# EAGLE schematic Display Pics (EAGLE 6.4)

## Sheet 1 of 9
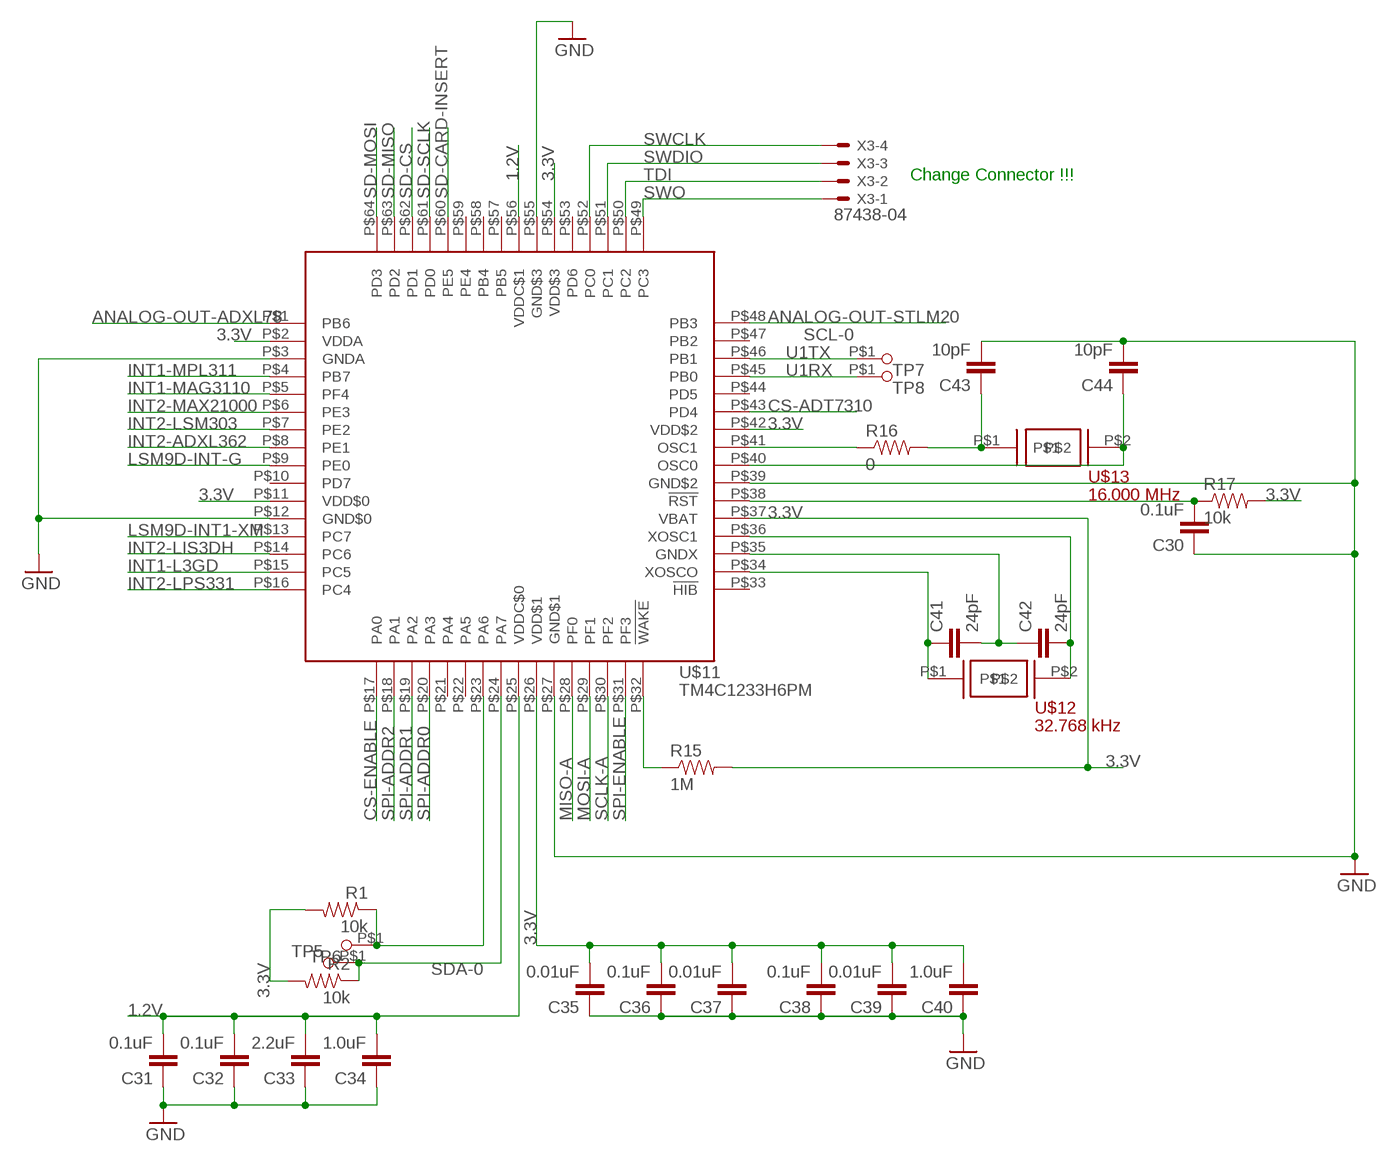
[diagram p0: schematic, sheet 1]

### Parts
C30  0.1uF  CAPACITOR  [0402-CAP]
C31  0.1uF  CAPACITOR  [0402-CAP]
C32  0.1uF  CAPACITOR  [0402-CAP]
C33  2.2uF  CAPACITOR  [0402-CAP]
C34  1.0uF  CAPACITOR  [0402-CAP]
C35  0.01uF  CAPACITOR  [0402-CAP]
C36  0.1uF  CAPACITOR  [0402-CAP]
C37  0.01uF  CAPACITOR  [0402-CAP]
C38  0.1uF  CAPACITOR  [0402-CAP]
C39  0.01uF  CAPACITOR  [0402-CAP]
C40  1.0uF  CAPACITOR  [0402-CAP]
C41  24pF  CAPACITOR  [0402-CAP]
C42  24pF  CAPACITOR  [0402-CAP]
C43  10pF  CAPACITOR  [0402-CAP]
C44  10pF  CAPACITOR  [0402-CAP]
R1  10k  RESISTOR  [0402-RES]
R2  10k  RESISTOR  [0402-RES]
R15  1M  RESISTOR  [0402-RES]
R16  0  RESISTOR  [0402-RES]
R17  10k  RESISTOR  [0402-RES]
TP5  TESTPAD(ROUND)  [TESTPAD(ROUND)]
TP6  TESTPAD(ROUND)  [TESTPAD(ROUND)]
TP7  TESTPAD(ROUND)  [TESTPAD(ROUND)]
TP8  TESTPAD(ROUND)  [TESTPAD(ROUND)]
U$11  TM4C1233H6PM  [S-PQFP-G64]
U$12  32.768 kHz  AB26TRB  [CYLINDRICAL-(1.9DIAX6L)]
U$13  16.000 MHz  NX5032GA  [2-SMD]
X3  87438-04  [87438-04]

### Nets
1.2V: C31.2 C32.2 C33.2 C34.2 U$11.P$25(VDDC$0) U$11.P$56(VDDC$1) ; also sheet 8
3.3V: C35.2 C36.2 C37.2 C38.2 C39.2 C40.2 R1.2 R2.2 R15.2 R17.2 U$11.P$2(VDDA) U$11.P$11(VDD$0) U$11.P$26(VDD$1) U$11.P$37(VBAT) U$11.P$42(VDD$2) U$11.P$54(VDD$3) ; also sheet 2,3,4,5,6,7,8,9
ANALOG-OUT-ADXL78: U$11.P$1(PB6) ; also sheet 6
ANALOG-OUT-STLM20: U$11.P$48(PB3) ; also sheet 6
CS-ADT7310: U$11.P$43(PD4) ; also sheet 4
CS-ENABLE: U$11.P$17(PA0) ; also sheet 7
GND: C30.1 C31.1 C32.1 C33.1 C34.1 C35.1 C36.1 C37.1 C38.1 C39.1 C40.1 C43.2 C44.2 U$11.P$3(GNDA) U$11.P$12(GND$0) U$11.P$27(GND$1) U$11.P$39(GND$2) U$11.P$55(GND$3) ; also sheet 2,3,4,5,6,7,8,9
INT1-L3GD: U$11.P$15(PC5) ; also sheet 3
INT1-MAG3110: U$11.P$5(PF4) ; also sheet 5
INT1-MPL311: U$11.P$4(PB7) ; also sheet 5
INT2-ADXL362: U$11.P$8(PE1) ; also sheet 4
INT2-LIS3DH: U$11.P$14(PC6) ; also sheet 3
INT2-LPS331: U$11.P$16(PC4) ; also sheet 3
INT2-LSM303: U$11.P$7(PE2) ; also sheet 2
INT2-MAX21000: U$11.P$6(PE3) ; also sheet 9
LSM9D-INT1-XM: U$11.P$13(PC7) ; also sheet 2
LSM9D-INT-G: U$11.P$9(PE0) ; also sheet 2
MISO-A: U$11.P$28(PF0) ; also sheet 7
MOSI-A: U$11.P$29(PF1)
N$10: C30.2 R17.1 U$11.P$38(!RST)
N$11: C42.2 U$11.P$36(XOSC1) U$12.P$2
N$12: C41.1 U$11.P$34(XOSCO) U$12.P$1
N$13: C41.2 C42.1 U$11.P$35(GNDX)
N$14: C43.1 R16.2 U$13.P$1
N$16: C44.1 U$11.P$40(OSC0) U$13.P$2
N$17: R16.1 U$11.P$41(OSC1)
N$18: R15.1 U$11.P$32(!WAKE)
SCL-0: R1.1 TP6.P$1 U$11.P$23(PA6) ; also sheet 5
SCLK-A: U$11.P$30(PF2) ; also sheet 7
SD-CARD-INSERT: U$11.P$60(PE5) ; also sheet 7
SD-CS: U$11.P$62(PD1) ; also sheet 7
SD-MISO: U$11.P$63(PD2) ; also sheet 7
SD-MOSI: U$11.P$64(PD3) ; also sheet 7
SD-SCLK: U$11.P$61(PD0) ; also sheet 7
SDA-0: R2.1 TP5.P$1 U$11.P$24(PA7) ; also sheet 5
SPI-ADDR0: U$11.P$20(PA3) ; also sheet 7
SPI-ADDR1: U$11.P$19(PA2) ; also sheet 7
SPI-ADDR2: U$11.P$18(PA1) ; also sheet 7
SPI-ENABLE: U$11.P$31(PF3) ; also sheet 7
SWCLK: U$11.P$52(PC0) X3.4
SWDIO: U$11.P$51(PC1) X3.3
SWO: U$11.P$49(PC3) X3.1
TDI: U$11.P$50(PC2) X3.2
U1RX: TP8.P$1 U$11.P$45(PB0)
U1TX: TP7.P$1 U$11.P$46(PB1)
Unconnected: U$11.P$10(PD7) U$11.P$21(PA4) U$11.P$22(PA5) U$11.P$33(!HIB) U$11.P$44(PD5) U$11.P$47(PB2) U$11.P$53(PD6) U$11.P$57(PB5) U$11.P$58(PB4) U$11.P$59(PE4)

### Notes on the sheet
- Change Connector !!!

## Sheet 2 of 9
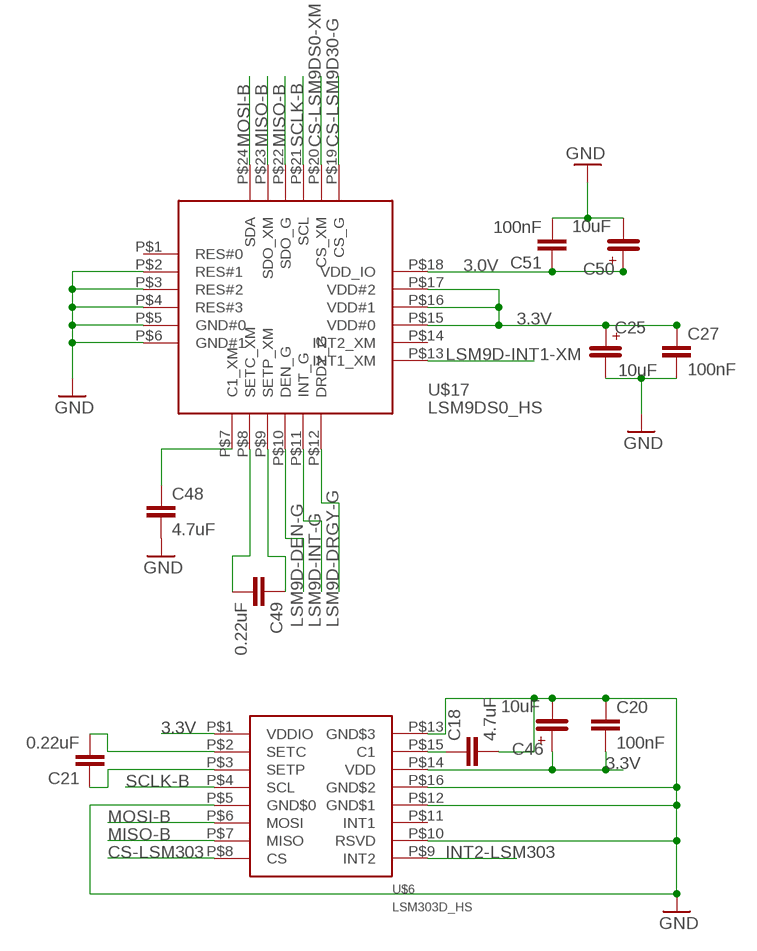
[diagram p1: schematic, sheet 2]

### Parts
C18  4.7uF  CAPACITOR  [0402-CAP]
C20  100nF  CAPACITOR  [0402-CAP]
C21  0.22uF  CAPACITOR  [0402-CAP]
C25  10uF  EEFCD0J100ER  [4.3X7.3SMD]
C27  100nF  CAPACITOR  [0402-CAP]
C46  10uF  EEFCD0J100ER  [4.3X7.3SMD]
C48  4.7uF  CAPACITOR  [0402-CAP]
C49  0.22uF  CAPACITOR  [0402-CAP]
C50  10uF  EEFCD0J100ER  [4.3X7.3SMD]
C51  100nF  CAPACITOR  [0402-CAP]
U$6  LSM303D_HS  [LGA-16(3X3)_HS]
U$17  LSM9DS0_HS  [LGA-24(4X4)_HS]

### Nets
3.0V: C50.P$1 C51.1 U$17.P$18(VDD_IO) ; also sheet 8
3.3V: C20.2 C25.P$1 C27.1 C46.P$1 U$6.P$1(VDDIO) U$6.P$14(VDD) U$17.P$15(VDD#0) U$17.P$16(VDD#1) U$17.P$17(VDD#2) ; also sheet 1,3,4,5,6,7,8,9
CS-LSM9D30-G: U$17.P$19(CS_G) ; also sheet 7
CS-LSM9DS0-XM: U$17.P$20(CS_XM) ; also sheet 7
CS-LSM303: U$6.P$8(CS) ; also sheet 7
GND: C18.2 C20.1 C25.P$2 C27.2 C46.P$2 C48.2 C50.P$2 C51.2 U$6.P$5(GND$0) U$6.P$10(RSVD) U$6.P$12(GND$1) U$6.P$13(GND$3) U$6.P$16(GND$2) U$17.P$2(RES#1) U$17.P$3(RES#2) U$17.P$4(RES#3) U$17.P$5(GND#0) U$17.P$6(GND#1) ; also sheet 1,3,4,5,6,7,8,9
INT2-LSM303: U$6.P$9(INT2) ; also sheet 1
LSM9D-DEN-G: U$17.P$10(DEN_G)
LSM9D-DRGY-G: U$17.P$12(DRDY_G)
LSM9D-INT1-XM: U$17.P$13(INT1_XM) ; also sheet 1
LSM9D-INT-G: U$17.P$11(INT_G) ; also sheet 1
MISO-B: U$6.P$7(MISO) U$17.P$22(SDO_G) U$17.P$23(SDO_XM) ; also sheet 3,4,7,9
MOSI-B: U$6.P$6(MOSI) U$17.P$24(SDA) ; also sheet 3,4,7,9
N$6: C18.1 U$6.P$15(C1)
N$7: C21.2 U$6.P$2(SETC)
N$8: C48.1 U$17.P$7(C1_XM)
N$15: C21.1 U$6.P$3(SETP)
N$21: C49.2 U$17.P$8(SETC_XM)
N$22: C49.1 U$17.P$9(SETP_XM)
SCLK-B: U$6.P$4(SCL) U$17.P$21(SCL) ; also sheet 3,4,7,9
Unconnected: U$6.P$11(INT1) U$17.P$1(RES#0) U$17.P$14(INT2_XM)

## Sheet 3 of 9
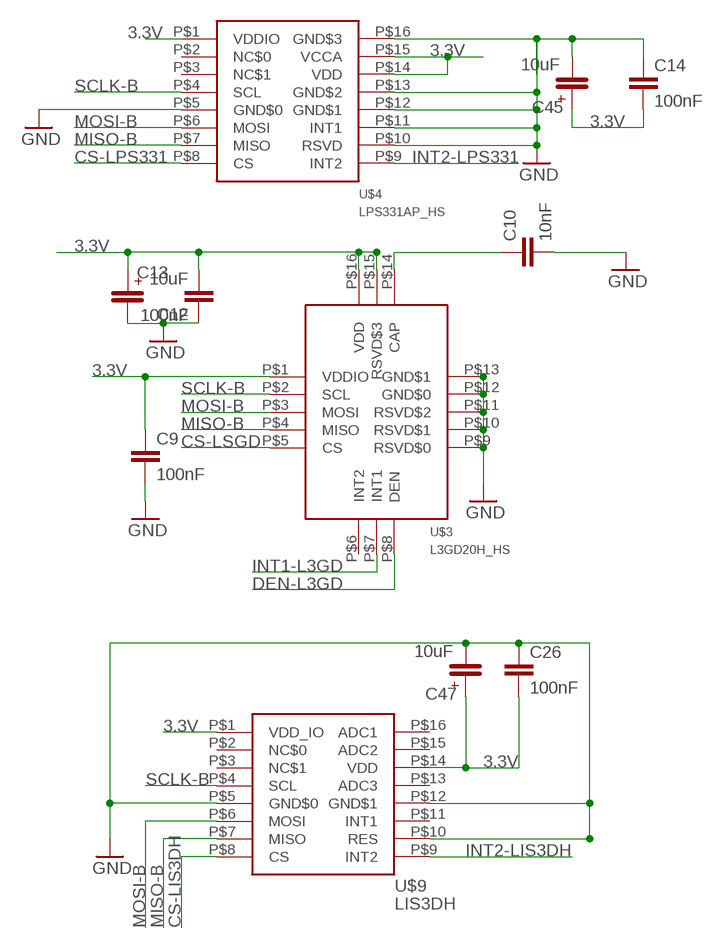
[diagram p2: schematic, sheet 3]

### Parts
C9  100nF  CAPACITOR  [0402-CAP]
C10  10nF  CAPACITOR  [0402-CAP]
C12  10uF  CAPACITOR  [0402-CAP]
C13  100nF  EEFCD0J100ER  [4.3X7.3SMD]
C14  100nF  CAPACITOR  [0402-CAP]
C26  100nF  CAPACITOR  [0402-CAP]
C45  10uF  EEFCD0J100ER  [4.3X7.3SMD]
C47  10uF  EEFCD0J100ER  [4.3X7.3SMD]
U$3  L3GD20H_HS  [LGA-16(3X3)_HS]
U$4  LPS331AP_HS  [LGA-16(3X3)_HS]
U$9  LIS3DH  LIS3DH_HS  [LGA-16(3X3)_HS]

### Nets
3.3V: C9.1 C12.2 C13.P$1 C14.2 C26.2 C45.P$1 C47.P$1 U$3.P$1(VDDIO) U$3.P$15(RSVD$3) U$3.P$16(VDD) U$4.P$1(VDDIO) U$4.P$14(VDD) U$4.P$15(VCCA) U$9.P$1(VDD_IO) U$9.P$14(VDD) ; also sheet 1,2,4,5,6,7,8,9
CS-LIS3DH: U$9.P$8(CS) ; also sheet 7
CS-LPS331: U$4.P$8(CS) ; also sheet 7
CS-LSGD: U$3.P$5(CS) ; also sheet 7
DEN-L3GD: U$3.P$8(DEN)
GND: C9.2 C10.2 C12.1 C13.P$2 C14.1 C26.1 C45.P$2 C47.P$2 U$3.P$9(RSVD$0) U$3.P$10(RSVD$1) U$3.P$11(RSVD$2) U$3.P$12(GND$0) U$3.P$13(GND$1) U$4.P$5(GND$0) U$4.P$10(RSVD) U$4.P$11(INT1) U$4.P$12(GND$1) U$4.P$13(GND$2) U$4.P$16(GND$3) U$9.P$5(GND$0) U$9.P$10(RES) U$9.P$12(GND$1) ; also sheet 1,2,4,5,6,7,8,9
INT1-L3GD: U$3.P$7(INT1) ; also sheet 1
INT2-LIS3DH: U$9.P$9(INT2) ; also sheet 1
INT2-LPS331: U$4.P$9(INT2) ; also sheet 1
MISO-B: U$3.P$4(MISO) U$4.P$7(MISO) U$9.P$7(MISO) ; also sheet 2,4,7,9
MOSI-B: U$3.P$3(MOSI) U$4.P$6(MOSI) U$9.P$6(MOSI) ; also sheet 2,4,7,9
N$4: C10.1 U$3.P$14(CAP)
SCLK-B: U$3.P$2(SCL) U$4.P$4(SCL) U$9.P$4(SCL) ; also sheet 2,4,7,9
Unconnected: U$3.P$6(INT2) U$4.P$2(NC$0) U$4.P$3(NC$1) U$9.P$2(NC$0) U$9.P$3(NC$1) U$9.P$11(INT1) U$9.P$13(ADC3) U$9.P$15(ADC2) U$9.P$16(ADC1)

## Sheet 4 of 9
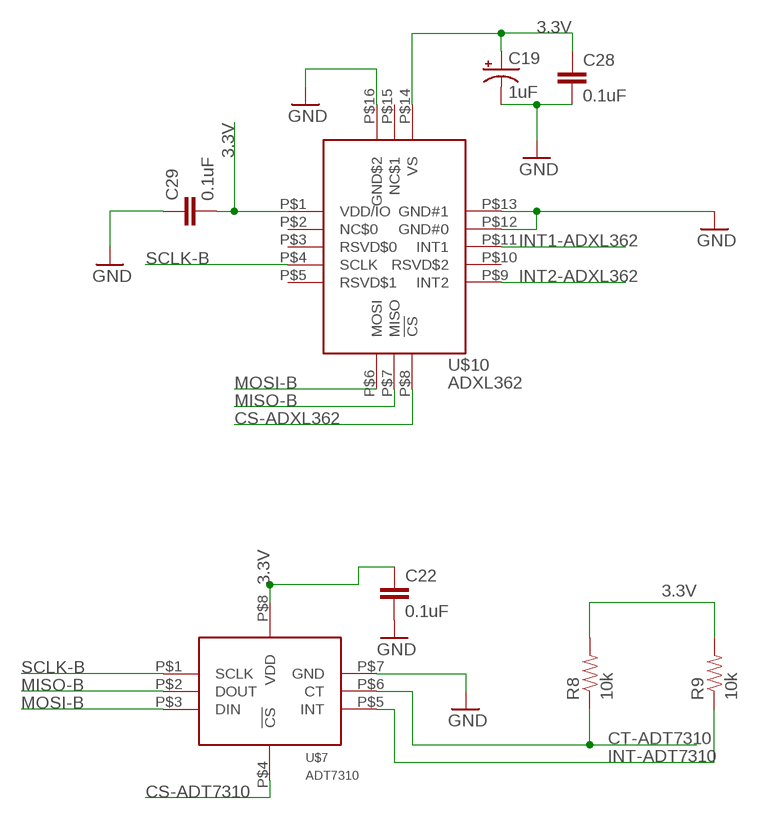
[diagram p3: schematic, sheet 4]

### Parts
C19  1uF  CAP_POL6032  [EIA6032]
C22  0.1uF  CAPACITOR  [0402-CAP]
C28  0.1uF  CAPACITOR  [0402-CAP]
C29  0.1uF  CAPACITOR  [0402-CAP]
R8  10k  RESISTOR  [0402-RES]
R9  10k  RESISTOR  [0402-RES]
U$7  ADT7310  [SOIC-8(5X6.2)]
U$10  ADXL362  ADXL362_HS  [LGA-16(3X3.25)_HS]

### Nets
3.3V: C19.P$1(+) C22.1 C28.1 C29.2 R8.2 R9.2 U$7.P$8(VDD) U$10.P$1(VDD/IO) U$10.P$14(VS) ; also sheet 1,2,3,5,6,7,8,9
CS-ADT7310: U$7.P$4(!CS) ; also sheet 1
CS-ADXL362: U$10.P$8(!CS) ; also sheet 7
CT-ADT7310: R8.1 U$7.P$6(CT)
GND: C19.P$2(-) C22.2 C28.2 C29.1 U$7.P$7(GND) U$10.P$12(GND#0) U$10.P$13(GND#1) U$10.P$16(GND$2) ; also sheet 1,2,3,5,6,7,8,9
INT1-ADXL362: U$10.P$11(INT1)
INT2-ADXL362: U$10.P$9(INT2) ; also sheet 1
INT-ADT7310: R9.1 U$7.P$5(INT)
MISO-B: U$7.P$2(DOUT) U$10.P$7(MISO) ; also sheet 2,3,7,9
MOSI-B: U$7.P$3(DIN) U$10.P$6(MOSI) ; also sheet 2,3,7,9
SCLK-B: U$7.P$1(SCLK) U$10.P$4(SCLK) ; also sheet 2,3,7,9
Unconnected: U$10.P$2(NC$0) U$10.P$3(RSVD$0) U$10.P$5(RSVD$1) U$10.P$10(RSVD$2) U$10.P$15(NC$1)

## Sheet 5 of 9
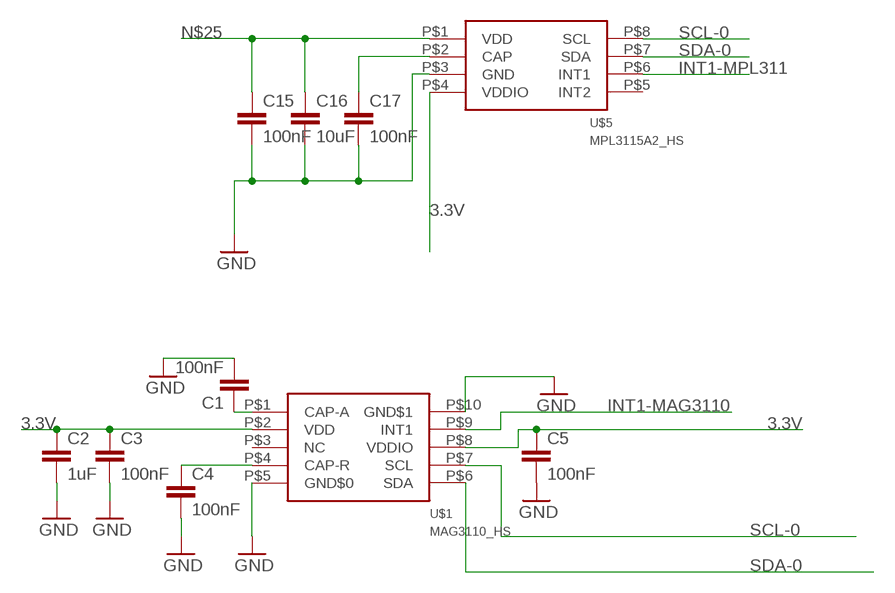
[diagram p4: schematic, sheet 5]

### Parts
C1  100nF  CAPACITOR  [0402-CAP]
C2  1uF  CAPACITOR  [0402-CAP]
C3  100nF  CAPACITOR  [0402-CAP]
C4  100nF  CAPACITOR  [0402-CAP]
C5  100nF  CAPACITOR  [0402-CAP]
C15  100nF  CAPACITOR  [0402-CAP]
C16  10uF  CAPACITOR  [0402-CAP]
C17  100nF  CAPACITOR  [0402-CAP]
U$1  MAG3110_HS  [DFN-10(2X2)_HS]
U$5  MPL3115A2_HS  [LGA-8(5X3)_HS]

### Nets
3.3V: C2.1 C3.1 C5.1 U$1.P$2(VDD) U$1.P$8(VDDIO) U$5.P$4(VDDIO) ; also sheet 1,2,3,4,6,7,8,9
GND: C1.2 C2.2 C3.2 C4.2 C5.2 C15.2 C16.2 C17.2 U$1.P$5(GND$0) U$1.P$10(GND$1) U$5.P$3(GND) ; also sheet 1,2,3,4,6,7,8,9
INT1-MAG3110: U$1.P$9(INT1) ; also sheet 1
INT1-MPL311: U$5.P$6(INT1) ; also sheet 1
N$1: C1.1 U$1.P$1(CAP-A)
N$3: C4.1 U$1.P$4(CAP-R)
N$5: C17.1 U$5.P$2(CAP)
N$25: C15.1 C16.1 U$5.P$1(VDD)
SCL-0: U$1.P$7(SCL) U$5.P$8(SCL) ; also sheet 1
SDA-0: U$1.P$6(SDA) U$5.P$7(SDA) ; also sheet 1
Unconnected: U$1.P$3(NC) U$5.P$5(INT2)

## Sheet 6 of 9
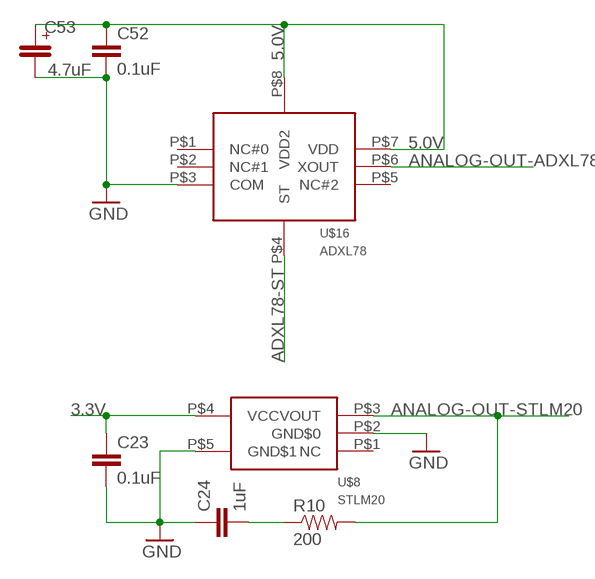
[diagram p5: schematic, sheet 6]

### Parts
C23  0.1uF  CAPACITOR  [0402-CAP]
C24  1uF  CAPACITOR  [0402-CAP]
C52  0.1uF  CAPACITOR  [0402-CAP]
C53  4.7uF  EEFCD0J100ER  [4.3X7.3SMD]
R10  200  RESISTOR  [0402-RES]
U$8  STLM20  [SOT323-5L]
U$16  ADXL78  [LCC-8(5X5)_HS]

### Nets
3.3V: C23.1 U$8.P$4(VCC) ; also sheet 1,2,3,4,5,7,8,9
5.0V: C52.1 C53.P$1 U$16.P$7(VDD) U$16.P$8(VDD2) ; also sheet 8
ADXL78-ST: U$16.P$4(ST)
ANALOG-OUT-ADXL78: U$16.P$6(XOUT) ; also sheet 1
ANALOG-OUT-STLM20: R10.2 U$8.P$3(VOUT) ; also sheet 1
GND: C23.2 C24.1 C52.2 C53.P$2 U$8.P$2(GND$0) U$8.P$5(GND$1) U$16.P$3(COM) ; also sheet 1,2,3,4,5,7,8,9
N$9: C24.2 R10.1
Unconnected: U$8.P$1(NC) U$16.P$1(NC#0) U$16.P$2(NC#1) U$16.P$5(NC#2)

## Sheet 7 of 9
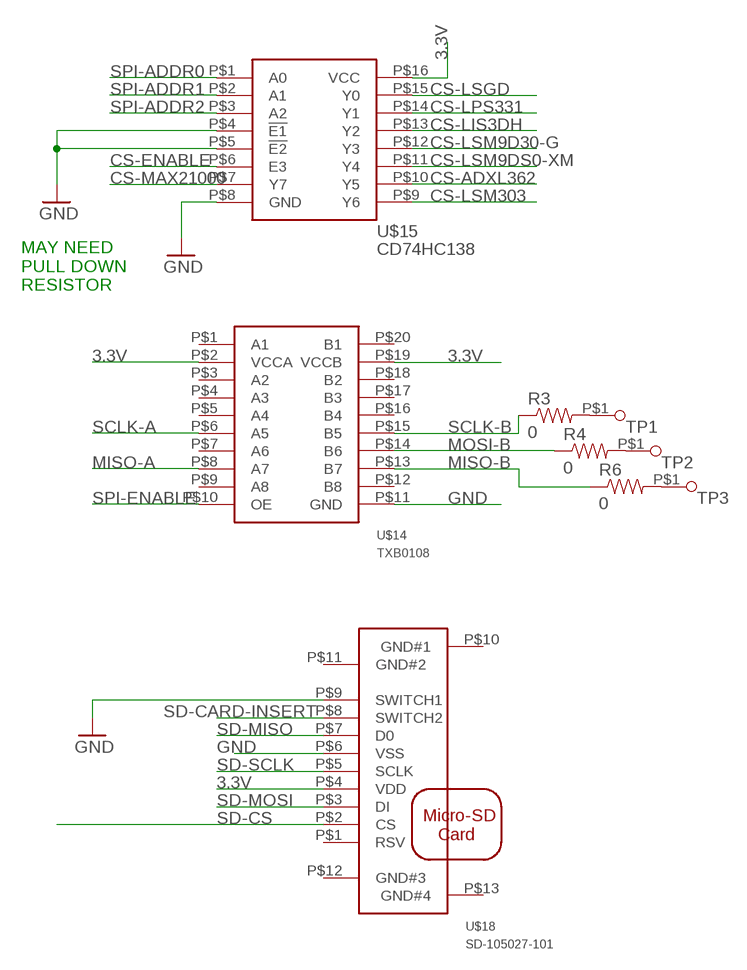
[diagram p6: schematic, sheet 7]

### Parts
R3  0  RESISTOR  [0402-RES]
R4  0  RESISTOR  [0402-RES]
R6  0  RESISTOR  [0402-RES]
TP1  TESTPAD(ROUND)  [TESTPAD(ROUND)]
TP2  TESTPAD(ROUND)  [TESTPAD(ROUND)]
TP3  TESTPAD(ROUND)  [TESTPAD(ROUND)]
U$14  TXB0108  [TSSOP-(PW)-20]
U$15  CD74HC138  [SOIC-16]
U$18  SD-105027-101  [SD-105027-101]

### Nets
3.3V: U$14.P$2(VCCA) U$14.P$19(VCCB) U$15.P$16(VCC) U$18.P$4(VDD) ; also sheet 1,2,3,4,5,6,8,9
CS-ADXL362: U$15.P$10(Y5) ; also sheet 4
CS-ENABLE: U$15.P$6(E3) ; also sheet 1
CS-LIS3DH: U$15.P$13(Y2) ; also sheet 3
CS-LPS331: U$15.P$14(Y1) ; also sheet 3
CS-LSGD: U$15.P$15(Y0) ; also sheet 3
CS-LSM9D30-G: U$15.P$12(Y3) ; also sheet 2
CS-LSM9DS0-XM: U$15.P$11(Y4) ; also sheet 2
CS-LSM303: U$15.P$9(Y6) ; also sheet 2
CS-MAX21000: U$15.P$7(Y7) ; also sheet 9
GND: U$14.P$11(GND) U$15.P$4(!E1) U$15.P$5(!E2) U$15.P$8(GND) U$18.P$6(VSS) U$18.P$9(SWITCH1) ; also sheet 1,2,3,4,5,6,8,9
MISO-A: U$14.P$8(A7) ; also sheet 1
MISO-B: R6.1 U$14.P$13(B7) ; also sheet 2,3,4,9
MOSI-B: R4.1 U$14.P$14(B6) ; also sheet 2,3,4,9
N$32: R3.2 TP1.P$1
N$33: R4.2 TP2.P$1
N$34: R6.2 TP3.P$1
SCLK-A: U$14.P$6(A5) ; also sheet 1
SCLK-B: R3.1 U$14.P$15(B5) ; also sheet 2,3,4,9
SD-CARD-INSERT: U$18.P$8(SWITCH2) ; also sheet 1
SD-CS: U$18.P$2(CS) ; also sheet 1
SD-MISO: U$18.P$7(D0) ; also sheet 1
SD-MOSI: U$18.P$3(DI) ; also sheet 1
SD-SCLK: U$18.P$5(SCLK) ; also sheet 1
SPI-ADDR0: U$15.P$1(A0) ; also sheet 1
SPI-ADDR1: U$15.P$2(A1) ; also sheet 1
SPI-ADDR2: U$15.P$3(A2) ; also sheet 1
SPI-ENABLE: U$14.P$10(OE) ; also sheet 1
Unconnected: U$14.P$1(A1) U$14.P$3(A2) U$14.P$4(A3) U$14.P$5(A4) U$14.P$7(A6) U$14.P$9(A8) U$14.P$12(B8) U$14.P$16(B4) U$14.P$17(B3) U$14.P$18(B2) U$14.P$20(B1) U$18.P$1(RSV) U$18.P$10(GND#1) U$18.P$11(GND#2) U$18.P$12(GND#3) U$18.P$13(GND#4)

### Notes on the sheet
- MAY NEED
  PULL DOWN
  RESISTOR

## Sheet 8 of 9
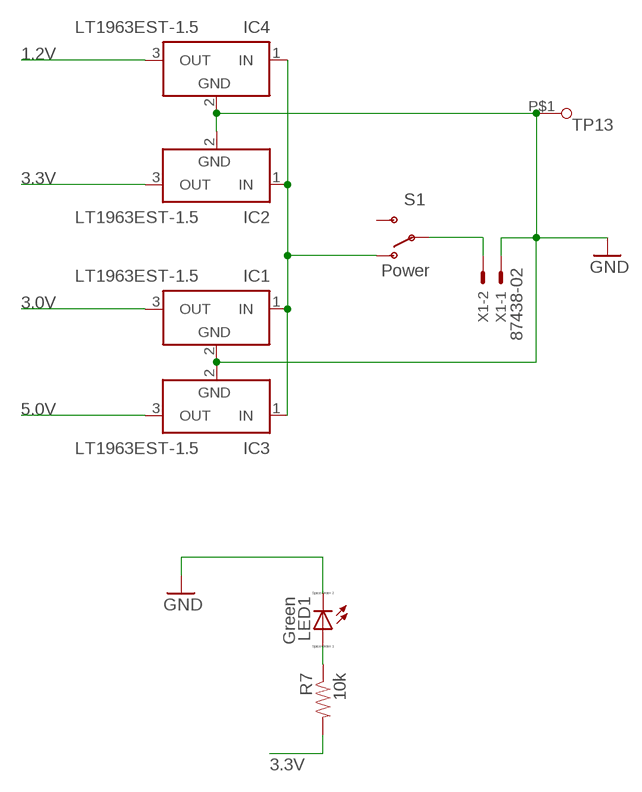
[diagram p7: schematic, sheet 8]

### Parts
IC1  LT1963EST-1.5  [SOT223]
IC2  LT1963EST-1.5  [SOT223]
IC3  LT1963EST-1.5  [SOT223]
IC4  LT1963EST-1.5  [SOT223]
LED1  Green  LED_ESML0603  [LED_SML0603]
R7  10k  RESISTOR  [0402-RES]
S1  Power  SWITCH-SPDT-SMD-A  [SWITCH-SPST-SMD-A]
TP13  TESTPAD(ROUND)  [TESTPAD(ROUND)]
X1  87438-02  [87438-02]

### Nets
1.2V: IC4.3(OUT) ; also sheet 1
3.0V: IC1.3(OUT) ; also sheet 2
3.3V: IC2.3(OUT) R7.2 ; also sheet 1,2,3,4,5,6,7,9
5.0V: IC3.3(OUT) ; also sheet 6
GND: IC1.2(GND) IC2.2(GND) IC3.2(GND) IC4.2(GND) LED1.C TP13.P$1 X1.1 ; also sheet 1,2,3,4,5,6,7,9
N$19: S1.2(P) X1.2
N$23: IC1.1(IN) IC2.1(IN) IC3.1(IN) IC4.1(IN) S1.1(O)
N$27: LED1.A R7.1
Unconnected: S1.3(S)

## Sheet 9 of 9
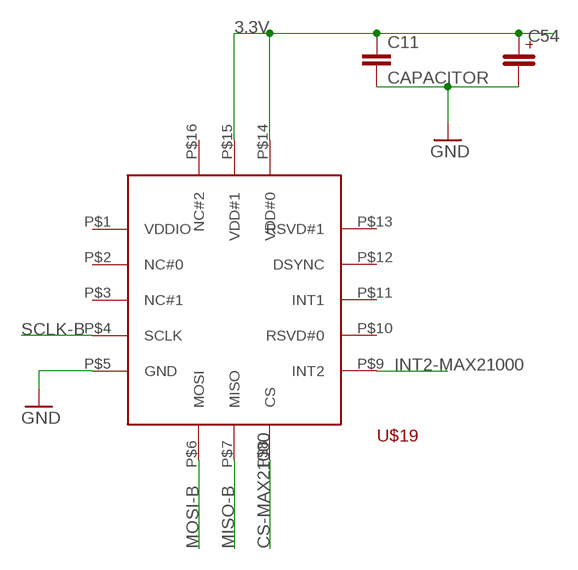
[diagram p8: schematic, sheet 9]

### Parts
C11  CAPACITOR  [0402-CAP]
C54  EEFCD0J100ER  [4.3X7.3SMD]
U$19  MAX21000_HS  [LGA-16(3X3)_HS]

### Nets
3.3V: C11.1 C54.P$1 U$19.P$14(VDD#0) U$19.P$15(VDD#1) ; also sheet 1,2,3,4,5,6,7,8
CS-MAX21000: U$19.P$8(CS) ; also sheet 7
GND: C11.2 C54.P$2 U$19.P$5(GND) ; also sheet 1,2,3,4,5,6,7,8
INT2-MAX21000: U$19.P$9(INT2) ; also sheet 1
MISO-B: U$19.P$7(MISO) ; also sheet 2,3,4,7
MOSI-B: U$19.P$6(MOSI) ; also sheet 2,3,4,7
SCLK-B: U$19.P$4(SCLK) ; also sheet 2,3,4,7
Unconnected: U$19.P$1(VDDIO) U$19.P$2(NC#0) U$19.P$3(NC#1) U$19.P$10(RSVD#0) U$19.P$11(INT1) U$19.P$12(DSYNC) U$19.P$13(RSVD#1) U$19.P$16(NC#2)

## Power pins joined to a net without a drawn wire
GND: IC1.4(GND) IC2.4(GND) IC3.4(GND) IC4.4(GND)

## Library data of the parts
C1-C5 C9-C12 C14-C18 C20-C24 C26-C44 C48 C49 C51 C52 = Kas-Passives:CAPACITOR: Ceramic SMT Capacitor
C13 C25 C45-C47 C50 C53 C54 = Kas-Passives:EEFCD0J100ER: ALU Capacitor
C19 = SparkFun-Passives:CAP_POL: Capacitor Polarized These are standard SMD and PTH capacitors. Normally 10uF, 47uF, and 100uF in electrolytic and tantalum varieties. Always verify the external diameter of the through hole cap, it varies with capacity, voltage, and manufacturer. The EIA devices should be standard.
IC1-IC4 = linear-technology:LT1963EST: 1.5A, Low Noise, Fast Transient Response LDO Regulator Source: http://www.linear.com/pc/downloadDocument.do?navId=H0,C3,P2222,D3148; MPN: LT1963EST-1.5; OC_FARNELL: 1663528; OC_NEWARK: 57M7534
LED1 = eagle-ltspice:LED_E: LED Source: http://www.osram.convergy.de Source: www.luxeon.com Source: www.kingbright.com; SPICEMODEL: NONE; SPICEPREFIX: D; SPICETYPE: diode
R1-R4 R6-R10 R15-R17 = Kas-Passives:RESISTOR: 0402 Resistor
S1 = SparkFun-Electromechanical:SWITCH-SPDT: SPDT Switch Simple slide switch, Spark Fun Electronics SKU : COM-00102 DPDT SMT slide switch, AYZ0202, SWCH-08179
TP1-TP3 TP5-TP8 TP13 = Kas-Passives:TESTPAD(ROUND)
U$1 = Kas-Sensors:MAG3110: MAG3110 in a 2x2 DFN-10 package
U$3 = Kas-Sensors:L3GD20H: L3GD20H in a 3x3 LGA-16 package
U$4 = Kas-Sensors:LPS331AP: LPS331AP in a 3x3 HCLGA-16 package
U$5 = Kas-Sensors:MPL3115A2: MPL3115A2 in a 3x5 LGA-8 package
U$6 = Kas-Sensors:LSM303D: LSM303D in a 3x3 LGA-16 package
U$7 = Kas-Sensors:ADT7310: ADT7310 in a 5x6.2 SOIC-8 package
U$8 = Kas-Sensors:STLM20: STLM20 in a 1.35x2.2 SOT323-5L package
U$9 = Kas-Sensors:LIS3DH: LIS3DH in a 3x3 LGA-16 package
U$10 = Kas-Sensors:ADXL362: ADXL362 in a 3x3.25 LGA-16 Package
U$11 = Kas-Microcontroller:TM4C1233H6PM: TM4C1233H6PM in a 10.2x10.2 S-PQFP-G64 package
U$12 = Kas-Crystal:AB26TRB: AB26TRB in a cylindrical (1.90mm x 6.00mm) package AB26TRB-32.768KHZ
U$13 = Kas-Crystal:NX5032GA: NX5032GA in a 2-SMD (5mmx3.2mm) package
U$14 = Kas-Buffers & Level Shifters:TXB0108
U$15 = Kas-Buffers & Level Shifters:CD74HC138
U$16 = Kas-Sensors:ADXL78: ADXL78 in a 5x5 LCC-8 package
U$17 = Kas-Sensors:LSM9DS0
U$18 = Kas-Connectors:SD-105027-101
U$19 = Kas-Sensors:MAX21000
X1 = con-molex:87438-02: Wire-to-Board 1.50mm (.059") Pitch Header - Right Angle, SMT, Shrouded Source: http://www.molex.com/product/micro/87438.html; OC_FARNELL: 1711327; OC_NEWARK: unknown
X3 = con-molex:87438-04: Wire-to-Board 1.50mm (.059") Pitch Header - Right Angle, SMT, Shrouded Source: http://www.molex.com/product/micro/87438.html; OC_FARNELL: unknown; OC_NEWARK: unknown